# Altium project Altium32_ExamplePCB.PrjPcb
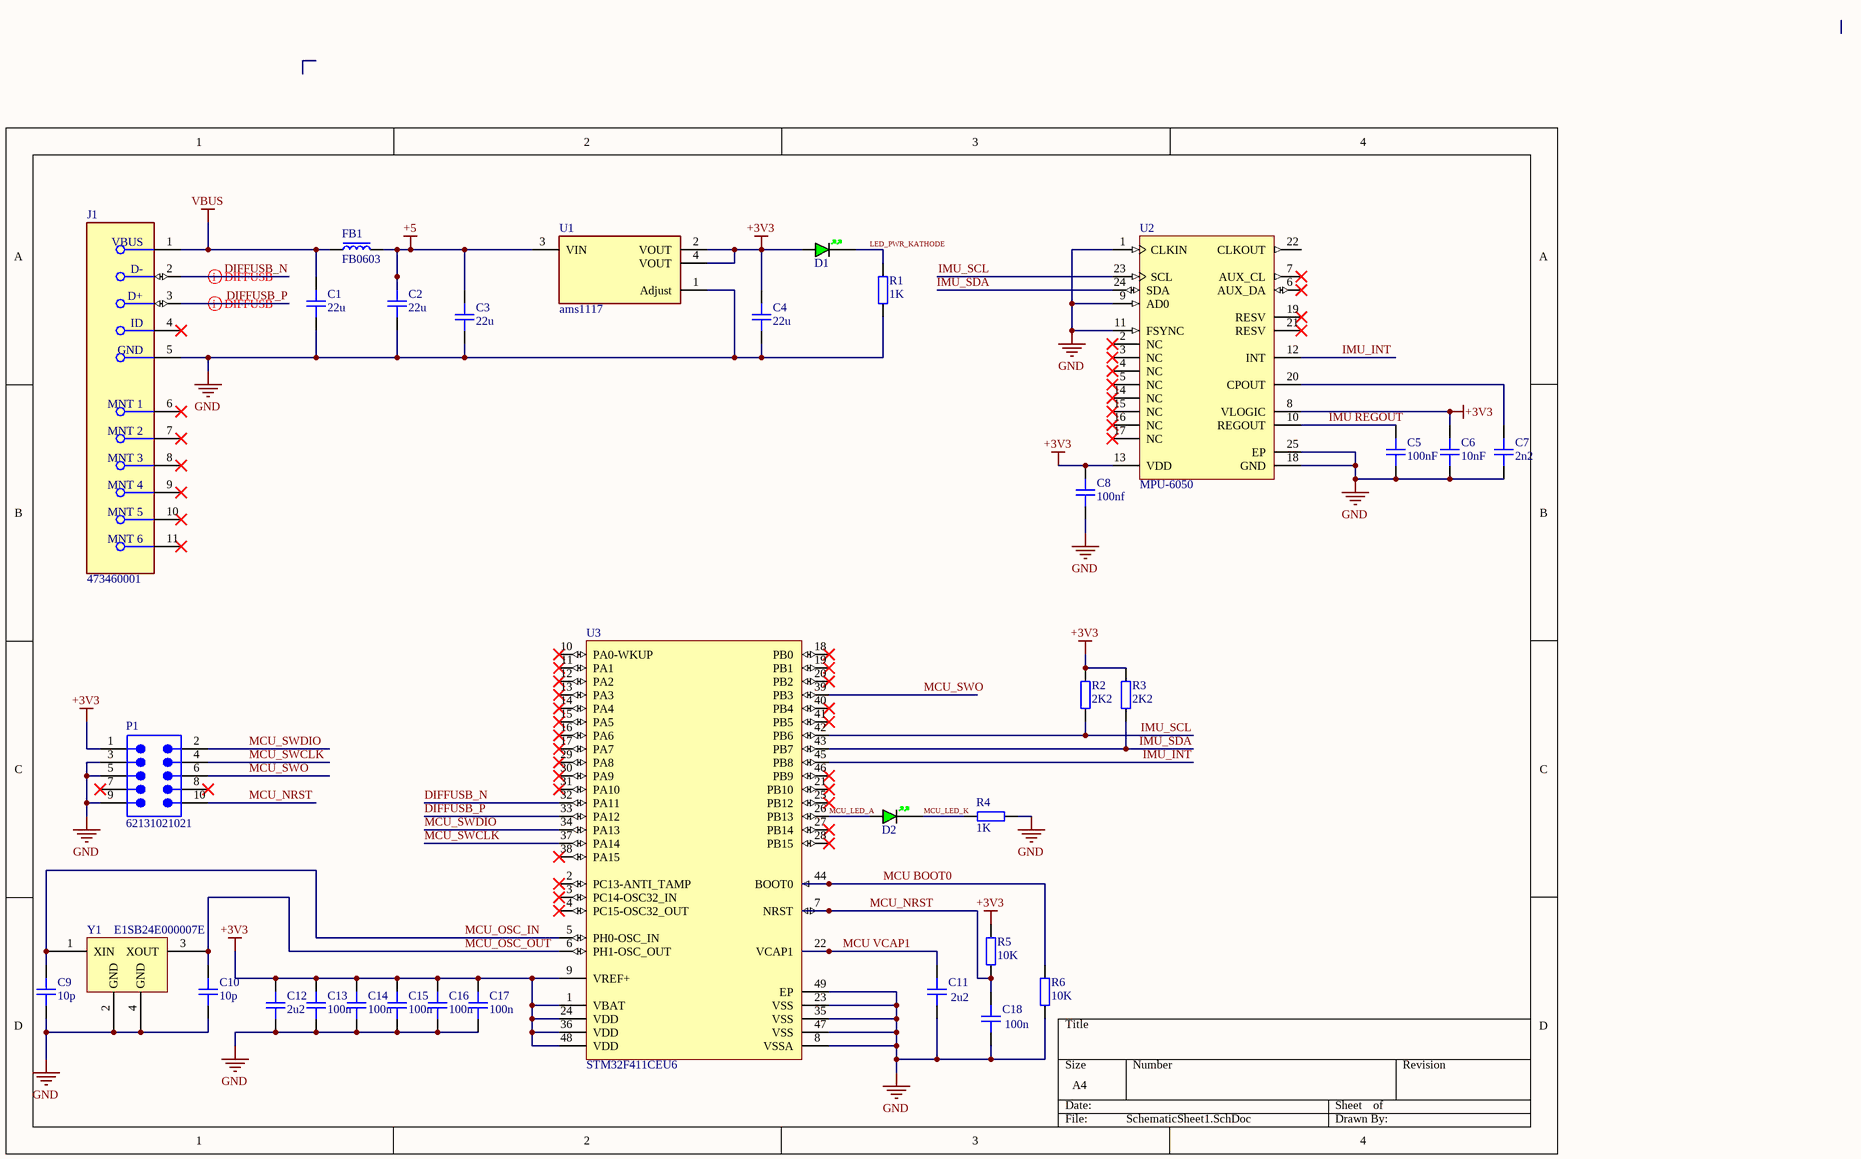
[diagram p0: SchematicSheet1.SchDoc]
1 sheet, 33 parts. Net scope: global (net labels, ports and power ports of the same name join across sheets).
Board file: PCB1.PcbDoc

## Sheet SchematicSheet1.SchDoc
size A4; SheetNumber: 1; SheetTotal: 1

### Parts
C1  22u  [CAP_0805]
C2  22u  [CAP_0805]
C3  22u  [CAP_0805]
C4  22u  [CAP_0805]
C5  100nF  [CAP_0805]
C6  10nF  [CAP_0805]
C7  2n2  [CAP_0805]
C8  100nf  [CAP_0805]
C9  10p  [CAP_0805]
C10  10p  [CAP_0805]
C11  2u2  [CAP_0805]
C12  2u2  [CAP_0805]
C13  100n  [CAP_0805]
C14  100n  [CAP_0805]
C15  100n  [CAP_0805]
C16  100n  [CAP_0805]
C17  100n  [CAP_0805]
C18  100n  [CAP_0805]
D1  GREEN  [LED_0402_GREEN]  (value not drawn)
D2  GREEN  [LED_0402_GREEN]  (value not drawn)
FB1  FB0603  [FB_0603]
J1  473460001  [FP-473460001-MFG]
P1  62131021021  [62131021021]
R1  1K  [RES_0402]
R2  2K2  [RES_0402]
R3  2K2  [RES_0402]
R4  1K  [RES_0402]
R5  10K  [RES_0402]
R6  10K  [RES_0402]
U1  ams1117  [FP-ams1117-IPC_C]
U2  MPU-6050  [IS-QFN-24_V]
U3  STM32F411CEU6  [STM-UFQFPN48_L]
Y1  E1SB24E000007E  [TROQ R940000171]

### Nets
+3V3: C4.2 C6.2 C8.2 C12.2 C13.2 C14.2 C15.2 C16.2 C17.2 D1.A P1.1 R2.2 R3.2 R5.1 U1.2(VOUT) U1.4(VOUT) U2.8(VLOGIC) U2.13(VDD) U3.1(VBAT) U3.9(VREF+) U3.24(VDD) U3.36(VDD) U3.48(VDD)
+5: C2.2 C3.2 FB1.2 U1.3(VIN)
GND: C1.1 C2.1 C3.1 C4.1 C5.1 C6.1 C7.1 C8.1 C9.1 C10.1 C11.1 C12.1 C13.1 C14.1 C15.1 C16.1 C17.1 C18.1 J1.5(GND) P1.3 P1.5 P1.9 R1.1 R4.1 R6.2 U1.1(Adjust) U2.1(CLKIN) U2.9(AD0) U2.11(FSYNC) U2.18(GND) U2.25(EP) U3.8(VSSA) U3.23(VSS) U3.35(VSS) U3.47(VSS) U3.49(EP) Y1.2(GND) Y1.4(GND)
VBUS: C1.2 FB1.1 J1.1(VBUS)
DIFFUSB_N: J1.2(D-) U3.32(PA11)
DIFFUSB_P: J1.3(D+) U3.33(PA12)
IMU REGOUT: C5.2 U2.10(REGOUT)
IMU_INT: U2.12(INT) U3.45(PB8)
IMU_SCL: R2.1 U2.23(SCL) U3.42(PB6)
IMU_SDA: R3.1 U2.24(SDA) U3.43(PB7)
LED_PWR_KATHODE: D1.K R1.2
MCU BOOT0: R6.1 U3.44(BOOT0)
MCU VCAP1: C11.2 U3.22(VCAP1)
MCU_LED_A: D2.A U3.26(PB13)
MCU_LED_K: D2.K R4.2
MCU_NRST: C18.2 P1.10 R5.2 U3.7(NRST)
MCU_OSC_IN: C9.2 U3.5(PH0-OSC_IN) Y1.1(XIN)
MCU_OSC_OUT: C10.2 U3.6(PH1-OSC_OUT) Y1.3(XOUT)
MCU_SWCLK: P1.4 U3.37(PA14)
MCU_SWDIO: P1.2 U3.34(PA13)
MCU_SWO: P1.6 U3.39(PB3)
NetC7_2: C7.2 U2.20(CPOUT)

Not connected (* = marked no-connect by the designer): J1 4(ID)* 6(MNT_1)* 7(MNT_2)* 8(MNT_3)* 9(MNT_4)* 10(MNT_5)* 11(MNT_6)*; P1 7* 8*; U2 2(NC)* 3(NC)* 4(NC)* 5(NC)* 6(AUX_DA)* 7(AUX_CL)* 14(NC)* 15(NC)* 16(NC)* 17(NC)* 19(RESV)* 21(RESV)* 22(CLKOUT); U3 2(PC13-ANTI_TAMP)* 3(PC14-OSC32_IN)* 4(PC15-OSC32_OUT)* 10(PA0-WKUP)* 11(PA1)* 12(PA2)* 13(PA3)* 14(PA4)* 15(PA5)* 16(PA6)* 17(PA7)* 18(PB0)* 19(PB1)* 20(PB2)* 21(PB10)* 25(PB12)* 27(PB14)* 28(PB15)* 29(PA8)* 30(PA9)* 31(PA10)* 38(PA15)* 40(PB4)* 41(PB5)* 46(PB9)*

### Layout directives
differential pair; differential pair class DIFFUSB: DIFFUSB_N, DIFFUSB_P

### Library data of the parts
C1-C18 = CAP_0805: Capacitor SMD 0805; Manufacturer: *; Manufacturer Part Number: *; Distributor Link: *; LCSC: *; Rating: *; Dielectric: *
D1 D2 = LED_0402_GREEN: LED 0402 GREEN SMD
FB1 = FB_0603: Ferrite Bead SMD 0603; Manufacturer: *; Manufacturer Part Number: *; Distributor Link: *; LCSC: *
J1 = CMP-2000-05246-2: CONN RCPT USB2.0 MICRO B SMD R/A; Manufacturer: Molex; Conn Orientation: Right Angle; Is Female: yes; Shielding: true; Pitch: 0.65mm; Number Of Contacts: 5; Voltage Rating: 30V; Current Rating: 1.8A; Device Class L2: USB Connectors; Digikey Description: CONN RCPT USB2.0 MICRO B SMD R/A; Height: 2.945mm; RoHS: TRUE; ComponentLink2Description: Datasheet; Octopart: https://octopart.com/47346-0001-molex-7164928; Automotive: No; Package: 0; Category: Conn; Device Class L1: Connectors; Usb Standard: USB 2.0; Temperature: -30°C to +85°C; Temperature Range Low: -30°C; Footprint Url: https://www.molex.com/pdm_docs/sd/473460001_sd.pdf; ComponentLink2URL: https://www.molex.com/webdocs/datasheets/pdf/en-us/0473460001_IO_CONNECTORS.pdf; Lead Free: Yes; Manufacturer Part Number: 473460001; Contact Material: Gold,Nickel; Temperature Range High: +85°C; Device Class L3: unset
P1 = CMP-1502-00938-3: NexarPartId: 107344426; Current Rating: 1A; Number of Contacts: 10; Voltage Rating: 100V; Max Operating Temperature: 105°C; Min Operating Temperature: -40°C; Number of Rows: 2; Contact Material: Gold
R1-R6 = RES_0402: Resistor SMD 0402; Manufacturer: *; Manufacturer Part Number: *; Distributor Link: *; LCSC: *
U1 = CMP-209535-000002-1: 1A LOW DROPOUT VOLTAGE REGULATOR; RoHS Compliant: Yes
U2 = CMP-1753-00002-2: 3-Axis Gyroscope, Accelerometer and a Digital Motion Processor(TM) (DMP), 2.375 to 3.46 V, -40 to 85 degC, 24-Pin QFN, RoHS, Tape and Reel; Manufacturer: InvenSense; Featured Product: MPU-60506-Axis,IntegratedI²CSolution; Other Names: 1428-1007-2 / MPU6050; Sensor Type: MotionTracking; Online Catalog: MPU-6000™Series; Unit PriceUSD: Digital; Datasheet Version: Rev. 3.3, 05/2012; Category: Sensors,Transducers; Datasheet URL: http://datasheet.octopart.com/MPU-6050-InvenSense-datasheet-14421344.pdf; Family: Multifunction; Standard Package: 5,000; Manufacturer URL: http://www.invensense.com/; Output Type: Digital; Dynamic Catalog: MPU-6000™Series
U3 = CMP-0243-00165-1: ARM Cortex-M4 32-bit MCU+FPU, 512 KB Flash, 128 KB RAM, 36 I/Os, 48-Pin UFQFPN, -40 to 85 degC, Tray; Operating Frequency(F) (Processor speed) (MHz): 100; FLASH Size (Prog) (kB): 512; Internal RAM Size (kB): 128; I/Os (High Current): 36; Supply Voltage(Vcc) min (V): 1.7; Package Reference: 48-Pin Ultra Thin Fine Pitch Quad Flat No-Lead, 7 x 7 x 0.6 mm Body, 0.5 mm Pitch, Exposed Pad; ComponentLink1Description: Manufacturer URL; ComponentLink1URL: http://www.st.com/; Packing: Tray; Package Description: UFQFPN48; Core: ARM Cortex-M4; ComponentLink2Description: Datasheet; ComponentLink2URL: http://www.st.com/st-web-ui/static/active/en/resource/technical/document/datasheet/DM00115249.pdf; DatasheetVersion: Rev. 6; Mounting Technology: Surface Mount
Y1 = E1SB24E000007E: 24MHz 9pF ±10ppm SMD2016-4P Crystals ROHS